# Altium schematic sheet LED_low_side_control.SchDoc: LED Low Power
size B; SheetNumber: 6; SheetTotal: 14
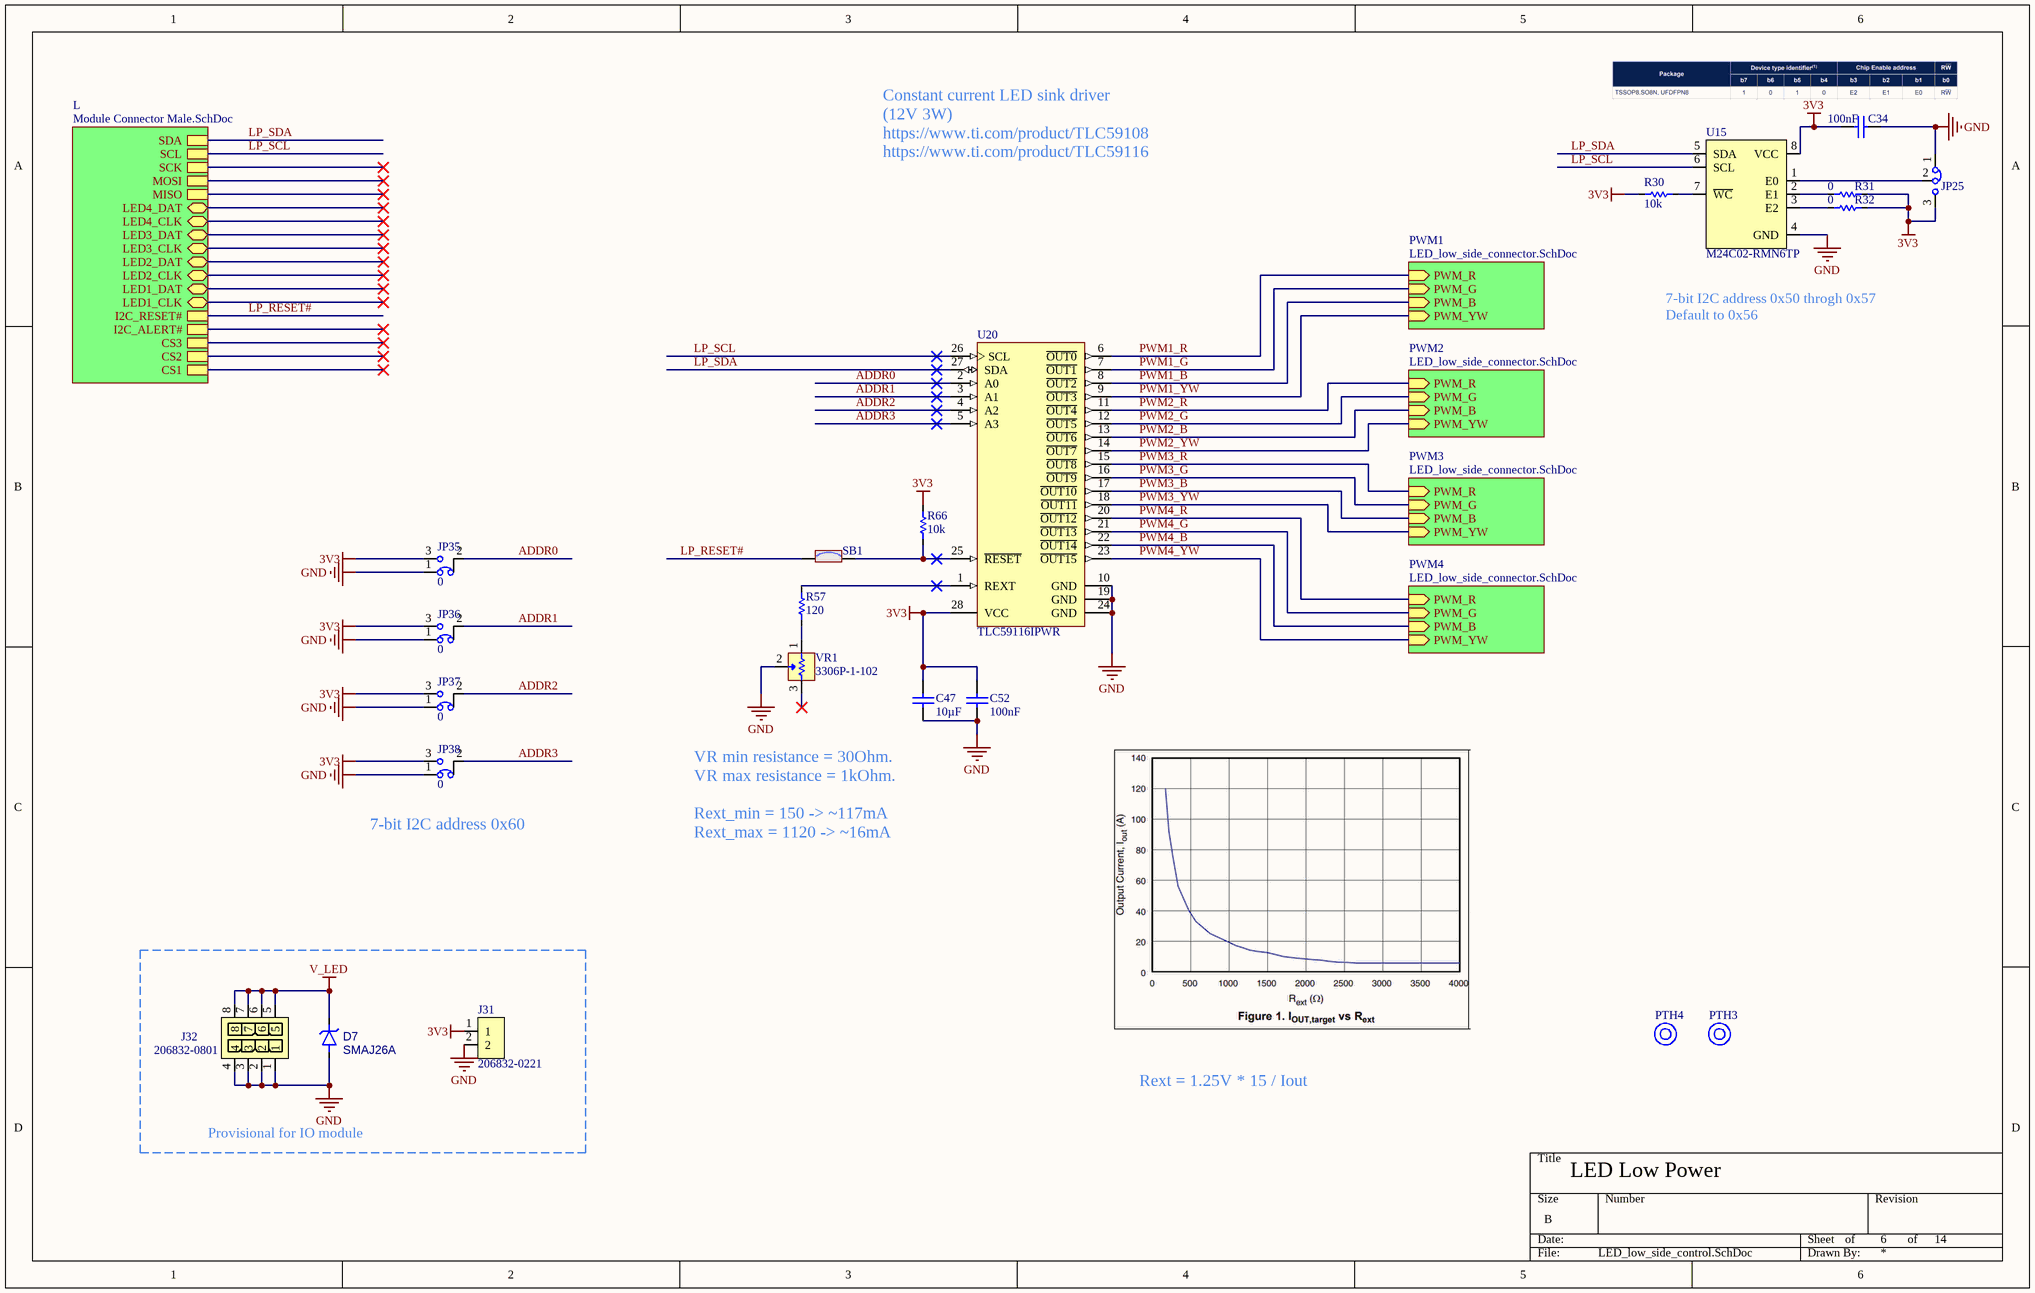
[diagram p0: LED_low_side_control.SchDoc]

## Parts
C34  value 100nF  [CAPC1608X10N_0603_MED]  (hidden comment: CC0603KRX7R0BB104)
C47  value 10µF  [CAPC2012X14N_0805_MED]  (hidden comment: GRM21BC81C106KA73L)
C52  value 100nF  [CAPC1608X10N_0603_MED]  (hidden comment: CC0603KRX7R0BB104)
D7  SMAJ26A  [FP-SMAJ-MFG]
J31  206832-0221  [206832-0221-Footprint-1]
J32  206832-0801  [206832-0801-Footprint-1]
JP25  Jumper 3 x 1 Bridge 1-2 Solder Bridge  [Jumper 3 Solder Bridge 1-2 0603]  (value not drawn)
JP35  value 0  [Jumper 3 Solder Bridge 1-2 0603]  (hidden comment: Jumper 3 x 1 Bridge 1-2 Solder Bridge)
JP36  value 0  [Jumper 3 Solder Bridge 1-2 0603]  (hidden comment: Jumper 3 x 1 Bridge 1-2 Solder Bridge)
JP37  value 0  [Jumper 3 Solder Bridge 1-2 0603]  (hidden comment: Jumper 3 x 1 Bridge 1-2 Solder Bridge)
JP38  value 0  [Jumper 3 Solder Bridge 1-2 0603]  (hidden comment: Jumper 3 x 1 Bridge 1-2 Solder Bridge)
PTH3  Mounting Hole NPTH  [Mounting Hole M3 No Washer NPTH]  (value not drawn)  (no BOM)
PTH4  Mounting Hole NPTH  [Mounting Hole M3 No Washer NPTH]  (value not drawn)  (no BOM)
R30  value 10k  [RESC1608X06N_0603_MED]  (hidden comment: RC0603FR-1010KL)
R31  value 0  [RESC1608X06N_0603_MED]  (hidden comment: RC0603FR-070RL)
R32  value 0  [RESC1608X06N_0603_MED]  (hidden comment: RC0603FR-070RL)
R57  value 120  [RESC1608X06N_0603_MED]  (hidden comment: RC0603FR-07120RL)
R66  value 10k  [RESC1608X06N_0603_MED]  (hidden comment: RC0603FR-1010KL)
SB1  SolderBridge0603_On  [SOLDER-BRIDGE_R0603-0R]  (value not drawn)
U15  M24C02-RMN6TP  [M24C02-RMN6TP-SO8N-IPC_B]
U20  TLC59116IPWR  [PW0028A_L]
VR1  3306P-1-102  [3306P-1-102-Footprint-1]

## Sub-sheets
L = Module Connector Male.SchDoc: SDA, SCL, SCK, MOSI, MISO, LED4_DAT (bidir), LED4_CLK (bidir), LED3_DAT (bidir), LED3_CLK (bidir), LED2_DAT (bidir), LED2_CLK (bidir), LED1_DAT (bidir), LED1_CLK (bidir), I2C_RESET#, I2C_ALERT#, CS3, CS2, CS1
PWM1 = LED_low_side_connector.SchDoc: PWM_B (in), PWM_G (in), PWM_R (in), PWM_YW (in)
PWM2 = LED_low_side_connector.SchDoc: PWM_B (in), PWM_G (in), PWM_R (in), PWM_YW (in)
PWM3 = LED_low_side_connector.SchDoc: PWM_B (in), PWM_G (in), PWM_R (in), PWM_YW (in)
PWM4 = LED_low_side_connector.SchDoc: PWM_B (in), PWM_G (in), PWM_R (in), PWM_YW (in)

## Nets
3V3: C34.1 C47.2 C52.1 J31.1 JP25.3 JP35.3 JP36.3 JP37.3 JP38.3 R30.2 R31.1 R32.1 R66.2 U15.8(VCC) U20.28(VCC)
GND: C34.2 C47.1 C52.2 D7.2(A) J31.2 J32.1 J32.2 J32.3 J32.4 JP25.1 JP35.1 JP36.1 JP37.1 JP38.1 U15.4(GND) U20.10(GND) U20.19(GND) U20.24(GND) VR1.2(Wipe)
V_LED: D7.1(K) J32.5 J32.6 J32.7 J32.8
ADDR0: JP35.2 U20.2(A0)
ADDR1: JP36.2 U20.3(A1)
ADDR2: JP37.2 U20.4(A2)
ADDR3: JP38.2 U20.5(A3)
LP_RESET#: SB1.1 ; sheet L/I2C_RESET#
LP_SCL: U15.6(SCL) U20.26(SCL) ; sheet L/SCL
LP_SDA: U15.5(SDA) U20.27(SDA) ; sheet L/SDA
PWM1_B: U20.8(~{OUT2}) ; sheet PWM1/PWM_B
PWM1_G: U20.7(~{OUT1}) ; sheet PWM1/PWM_G
PWM1_R: U20.6(~{OUT0}) ; sheet PWM1/PWM_R
PWM1_YW: U20.9(~{OUT3}) ; sheet PWM1/PWM_YW
PWM2_B: U20.13(~{OUT6}) ; sheet PWM2/PWM_B
PWM2_G: U20.12(~{OUT5}) ; sheet PWM2/PWM_G
PWM2_R: U20.11(~{OUT4}) ; sheet PWM2/PWM_R
PWM2_YW: U20.14(~{OUT7}) ; sheet PWM2/PWM_YW
PWM3_B: U20.17(~{OUT10}) ; sheet PWM3/PWM_B
PWM3_G: U20.16(~{OUT9}) ; sheet PWM3/PWM_G
PWM3_R: U20.15(~{OUT8}) ; sheet PWM3/PWM_R
PWM3_YW: U20.18(~{OUT11}) ; sheet PWM3/PWM_YW
PWM4_B: U20.22(~{OUT14}) ; sheet PWM4/PWM_B
PWM4_G: U20.21(~{OUT13}) ; sheet PWM4/PWM_G
PWM4_R: U20.20(~{OUT12}) ; sheet PWM4/PWM_R
PWM4_YW: U20.23(~{OUT15}) ; sheet PWM4/PWM_YW
NetJP25_2: JP25.2 U15.1(E0)
NetR30_1: R30.1 U15.7(~{WC})
NetR31_2: R31.2 U15.2(E1)
NetR32_2: R32.2 U15.3(E2)
NetR57_1: R57.1 VR1.1
NetR57_2: R57.2 U20.1(REXT)
NetR66_1: R66.1 SB1.2 U20.25(~{RESET})

Not connected (* = marked no-connect by the designer): VR1 3*

## Notes on the sheet
- Constant current LED sink driver
  (12V 3W)
  https://www.ti.com/product/TLC59108
  https://www.ti.com/product/TLC59116
- 7-bit I2C address 0x50 throgh 0x57
  Default to 0x56
- (near JP38) 7-bit I2C address 0x60
- VR min resistance = 30Ohm.
  VR max resistance = 1kOhm.
  Rext_min = 150 -> ~117mA
  Rext_max = 1120 -> ~16mA
- Rext = 1.25V * 15 / Iout
- Provisional for IO module
- of

## Library data of the parts
C34 C52 = CMP-001-00102-4: Ceramic Capacitor, Multilayer, Ceramic, 100V, 10% +Tol, 10% -Tol, X7R, 15% TC, 0.1uF, Surface Mount, 0603; Max Operating Temperature: 125°C; RoHS Compliant: Yes; Case/Package: 0603; Mounting Technology: Surface Mount; Capacitor Type: Ceramic; Pins: 2; Voltage Rating: 100V; Min Operating Temperature: -55°C; JLCPN: C113803
C47 = CMP-001-00084-4: Ceramic Capacitor, Multilayer, Ceramic, 10uF, 16V, 10%, X6S, 0805; RoHS Compliant: Yes; Max Operating Temperature: 105°C; Case/Package: 0805; Pins: 2; Tolerance: 10%; Min Operating Temperature: -55°C; Mounting Technology: Surface Mount; Voltage Rating: 16V; Capacitor Type: Ceramic; JLCPN: C162413
D7 = CMP-004-00046-2: Trans Voltage Suppressor Diode, 400W, 26V V(RWM), Unidirectional, 1 Element, Silicon, DO-214AC; Min Operating Temperature: -65°C; RoHS Compliant: Yes; Max Operating Temperature: 150°C; Pins: 2; JLCPN: C148225
J31 = CMP-002-00210-4: Micro-Fit+, Vertial Header, 2 Position 3mm pitch; Max Current Rating: 12.5A; Gender: Male; Pins: 2; Connector Type: Micro-Fit+
J32 = CMP-002-00208-6: Micro-Fit+, Vertical Header, 8 pin; Max Current Rating: 12.5A; Connector Type: Micro-Fit+; Mounting Technology: Through Hole; Pins: 8
JP25 = CMP-009-00341-2: 0603 Solder Bridge Jumper Surface Mount; Tolerance: 1%; Voltage Rating: 75V; Value: 0; Pins: 2; Case/Package: 0603; RoHS Compliant: Yes; Max Operating Temperature: 155°C; Min Operating Temperature: -55°C; Mounting Technology: Surface Mount
JP35-JP38 = CMP-009-00341-2: 0603 Solder Bridge Jumper Surface Mount; Tolerance: 1%; Voltage Rating: 75V; Pins: 2; Case/Package: 0603; Min Operating Temperature: -55°C; Mounting Technology: Surface Mount; Max Operating Temperature: 155°C; RoHS Compliant: Yes
PTH3 PTH4 = CMP-00028-00043-3
R30 R66 = CMP-009-00306-2: Fixed Resistor, Metal Glaze/thick Film, 0.1W, 10000ohm, 75V, 1% +/-Tol, 100ppm/Cel, Surface Mount, 0603; Power: 100mW; Voltage Rating: 50V; Max Operating Temperature: 155°C; Case/Package: 0603; Mounting Technology: Surface Mount; Tolerance: 1%; Min Operating Temperature: -55°C; RoHS Compliant: Yes; Pins: 2; JLCPN: C98220
R31 R32 = CMP-009-00204-3: RC Series 0603 0.1 W 0 Ohm Jumper Surface Mount Thick Film Chip Resistor; Power: 100mW; Voltage Rating: 75V; Tolerance: 1%; Mounting Technology: Surface Mount; Pins: 2; Case/Package: 0603; Max Operating Temperature: 155°C; Min Operating Temperature: -55°C; RoHS Compliant: Yes; JLCPN: C100044
R57 = CMP-009-00303-2: Res General Purpose Thick Film 0603 120 Ohm 1% 1/10W ±100ppm/°C Molded SMD Paper T/R; Power: 100mW; Voltage Rating: 50V; Min Operating Temperature: -55°C; Tolerance: 1%; Max Operating Temperature: 155°C; Case/Package: 0603; Pins: 2; Mounting Technology: Surface Mount; RoHS Compliant: Yes; JLCPN: C114640
SB1 = CMP-128-000020-6: Solder Bridge ON; Internal_Part_Number: MCD-00071; Manufacturer: YAGEO; Part_Type: Mechanical; Manufacturer_Part_Number: RC0603JR-070RL; Provided_By: SUBCO; ECCN_EU: n/a; Package: SB0603; ComponentLink1Description: Datasheet; Source: MB1404.SCHLIB; Status: Released; Design Item ID: SolderBridge0603_On; ComponentLink1URL: http://tunmcdsvn.tun.st.com/Component_Datasheet_Library/Trunk/Resistors/Yageo_Resistor_RC0603-series; ECCN_US: n/a; JLCPN: C100044
U15 = CMP-019-00078-2: M24C02 Series 2 Kb (256 x 8) 1.8 V SMT Serial I²C Bus EEPROM - SOIC-8; Max Supply Voltage: 5.5V; Min Supply Voltage: 1.8V; Frequency: 400kHz; Memory Size: 256B; Case/Package: SOIC; Pins: 8; Clock Frequency: 400kHz; Min Operating Temperature: -40°C; Memory Format: EEPROM; Max Operating Temperature: 85°C; Mounting Technology: Surface Mount; JLCPN: C83836
U20 = CMP-00024-00008-2: LED Driver, 16-Segment, PDSO28; Nominal Supply Voltage: 3.3V; Case/Package: TSSOP; Min Operating Temperature: -40°C; Max Operating Temperature: 85°C; Pins: 28; RoHS Compliant: Yes; JLCPN: C131194
VR1 = CMP-00028-00042-1: Trimmer, Cermet, 0.2W, 1000ohm, 100V, 25% +/-Tol, 250ppm/Cel, 1 Turn(s); Pins: 3; Mounting Technology: Through Hole; Max Operating Temperature: 100°C; RoHS Compliant: Yes; Min Operating Temperature: -25°C